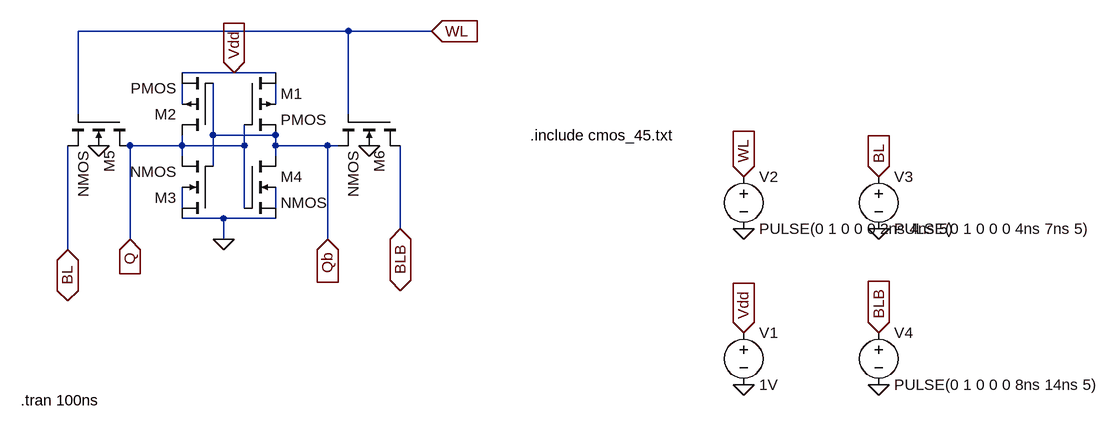
[diagram p0: schematic 6Tcell.asc]
6Tcell.asc, the LTspice schematic file:
Version 4
SHEET 1 1396 680
WIRE 224 16 -192 16
WIRE 352 16 224 16
WIRE 48 80 -32 80
WIRE 112 80 48 80
WIRE -32 128 -32 96
WIRE 112 128 112 96
WIRE -192 144 -192 16
WIRE 224 144 224 16
WIRE 16 176 16 96
WIRE 112 176 16 176
WIRE -32 192 -32 176
WIRE -32 192 -112 192
WIRE 64 192 64 160
WIRE 64 192 -32 192
WIRE 112 192 112 176
WIRE 192 192 112 192
WIRE 208 192 192 192
WIRE -32 208 -32 192
WIRE 112 208 112 192
WIRE 16 224 16 176
WIRE -32 288 -32 256
WIRE -16 288 -32 288
WIRE 64 288 64 192
WIRE 112 288 112 256
WIRE 32 304 -32 304
WIRE 112 304 32 304
WIRE 304 320 304 192
WIRE -112 336 -112 192
WIRE 32 336 32 304
WIRE 192 336 192 192
WIRE -208 352 -208 192
FLAG 32 336 0
FLAG 256 192 0
FLAG -160 192 0
FLAG 48 80 Vdd
IOPIN 48 80 In
FLAG -208 352 BL
IOPIN -208 352 BiDir
FLAG 304 320 BLB
IOPIN 304 320 BiDir
FLAG 352 16 WL
IOPIN 352 16 In
FLAG 832 560 0
FLAG 832 480 Vdd
IOPIN 832 480 In
FLAG 832 240 WL
IOPIN 832 240 In
FLAG 1040 240 BL
IOPIN 1040 240 In
FLAG 1040 480 BLB
IOPIN 1040 480 In
FLAG 832 320 0
FLAG 1040 320 0
FLAG 1040 560 0
FLAG -112 336 Q
IOPIN -112 336 In
FLAG 192 336 Qb
IOPIN 192 336 In
SYMBOL pmos4 64 80 R0
SYMATTR InstName M1
SYMATTR Value2 l=45nm w=45nm
SYMBOL pmos4 16 176 R180
SYMATTR InstName M2
SYMATTR Value2 l=45nm w=45nm
SYMBOL nmos4 16 304 R180
SYMATTR InstName M3
SYMATTR Value2 l=45nm w=90nm
SYMBOL nmos4 64 208 R0
SYMATTR InstName M4
SYMATTR Value2 l=45nm w=90nm
SYMBOL nmos4 -112 144 R90
SYMATTR InstName M5
SYMATTR Value2 l=45nm w=75nm
SYMBOL nmos4 304 144 R90
SYMATTR InstName M6
SYMATTR Value2 l=45nm w=75nm
SYMBOL voltage 832 464 R0
WINDOW 123 0 0 Left 0
WINDOW 39 0 0 Left 0
SYMATTR InstName V1
SYMATTR Value 1V
SYMBOL voltage 832 224 R0
WINDOW 123 0 0 Left 0
WINDOW 39 0 0 Left 0
SYMATTR InstName V2
SYMATTR Value PULSE(0 1 0 0 0 2ns 4ns 5)
SYMBOL voltage 1040 224 R0
WINDOW 123 0 0 Left 0
WINDOW 39 0 0 Left 0
SYMATTR InstName V3
SYMATTR Value PULSE(0 1 0 0 0 4ns 7ns 5)
SYMBOL voltage 1040 464 R0
WINDOW 123 0 0 Left 0
WINDOW 39 0 0 Left 0
SYMATTR InstName V4
SYMATTR Value PULSE(0 1 0 0 0 8ns 14ns 5)
TEXT 504 176 Left 2 !.include cmos_45.txt
TEXT -280 584 Left 2 !.tran 100ns

The netlist it stands for:
* 6Tcell.asc
M1 Vdd Q Qb N002 PMOS l=45nm w=45nm
M2 Q Qb Vdd N001 PMOS l=45nm w=45nm
M3 0 Qb Q N003 NMOS l=45nm w=90nm
M4 Qb Q 0 N004 NMOS l=45nm w=90nm
M5 Q WL BL 0 NMOS l=45nm w=75nm
M6 BLB WL Qb 0 NMOS l=45nm w=75nm
V1 Vdd 0 1V
V2 WL 0 PULSE(0 1 0 0 0 2ns 4ns 5)
V3 BL 0 PULSE(0 1 0 0 0 4ns 7ns 5)
V4 BLB 0 PULSE(0 1 0 0 0 8ns 14ns 5)
.model NMOS NMOS
.model PMOS PMOS
.lib standard.mos
.include cmos_45.txt
.tran 100ns
.backanno
.end